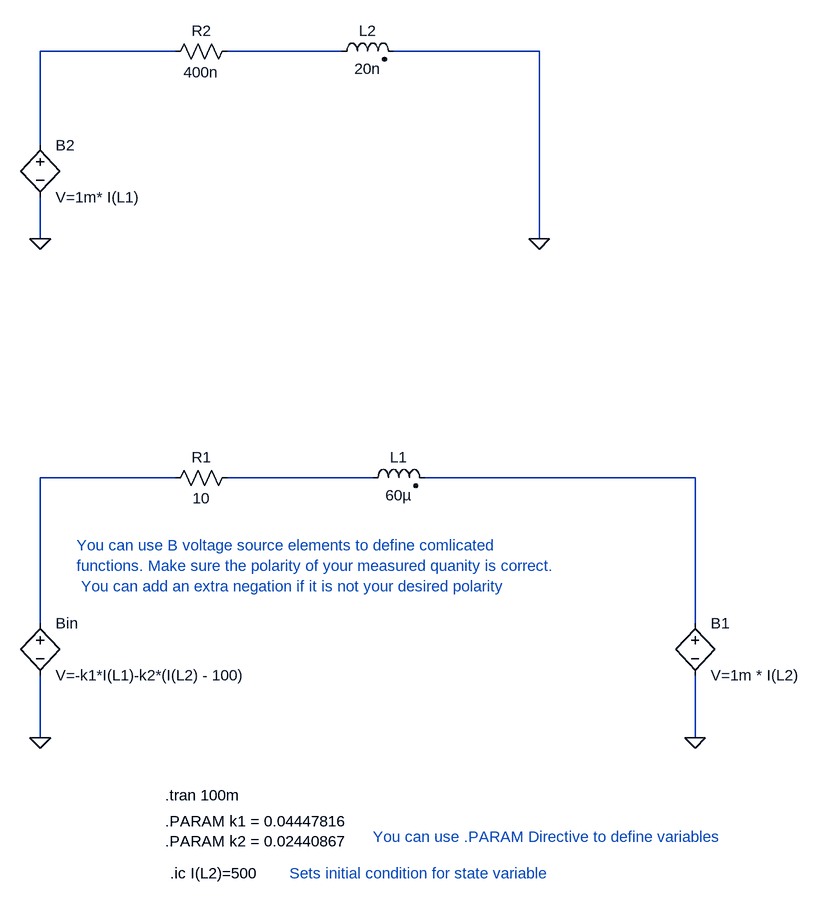
[diagram p0: schematic cl_model.asc]
cl_model.asc, the LTspice schematic file:
Version 4
SHEET 1 2392 832
WIRE 480 -448 272 -448
WIRE 736 -448 560 -448
WIRE 1040 -448 816 -448
WIRE 272 -304 272 -448
WIRE 272 -160 272 -224
WIRE 1040 -160 1040 -448
WIRE 480 208 272 208
WIRE 784 208 560 208
WIRE 1280 208 864 208
WIRE 272 432 272 208
WIRE 1280 432 1280 208
WIRE 272 608 272 512
WIRE 1280 608 1280 512
FLAG 272 608 0
FLAG 1280 608 0
FLAG 1040 -160 0
FLAG 272 -160 0
SYMBOL bv 272 416 R0
SYMATTR InstName Bin
SYMATTR Value V=-k1*I(L1)-k2*(I(L2) - 100)
SYMBOL res 576 192 R90
WINDOW 0 0 56 VBottom 2
WINDOW 3 32 56 VTop 2
SYMATTR InstName R1
SYMATTR Value 10
SYMBOL bv 1280 416 R0
SYMATTR InstName B1
SYMATTR Value V=1m * I(L2)
SYMBOL bv 272 -320 R0
SYMATTR InstName B2
SYMATTR Value V=1m* I(L1)
SYMBOL res 576 -464 R90
WINDOW 0 0 56 VBottom 2
WINDOW 3 32 56 VTop 2
SYMATTR InstName R2
SYMATTR Value 400n
SYMBOL ind2 720 -432 R270
WINDOW 0 32 56 VTop 2
WINDOW 3 5 56 VBottom 2
SYMATTR InstName L2
SYMATTR Value 20n
SYMATTR Type ind
SYMATTR SpiceLine Rser=0 Cpar=0
SYMBOL ind2 768 224 R270
WINDOW 0 32 56 VTop 2
WINDOW 3 5 56 VBottom 2
SYMATTR InstName L1
SYMATTR Value 60µ
SYMATTR Type ind
SYMATTR SpiceLine Rser=0 Cpar=0
TEXT 464 696 Left 2 !.tran 100m
TEXT 464 736 Left 2 !.PARAM k1 = 0.04447816\n.PARAM k2 = 0.02440867
TEXT 472 816 Left 2 !.ic I(L2)=500
TEXT 656 816 Left 2 ;Sets initial condition for state variable
TEXT 784 760 Left 2 ;You can use .PARAM Directive to define variables
TEXT 328 312 Left 2 ;You can use B voltage source elements to define comlicated \nfunctions. Make sure the polarity of your measured quanity is correct.\n You can add an extra negation if it is not your desired polarity

The netlist it stands for:
* cl_model.asc
Bin N003 0 V=-k1*I(L1)-k2*(I(L2) - 100)
R1 N004 N003 10
B1 N005 0 V=1m * I(L2)
B2 N001 0 V=1m* I(L1)
R2 N002 N001 400n
L2 N002 0 20n Rser=0 Cpar=0
L1 N004 N005 60µ Rser=0 Cpar=0
.tran 100m
.PARAM k1 = 0.04447816
.PARAM k2 = 0.02440867
.ic I(L2)=500
* Sets initial condition for state variable
* You can use .PARAM Directive to define variables
* You can use B voltage source elements to define comlicated
* functions. Make sure the polarity of your measured quanity is correct.
*  You can add an extra negation if it is not your desired polarity
.backanno
.end